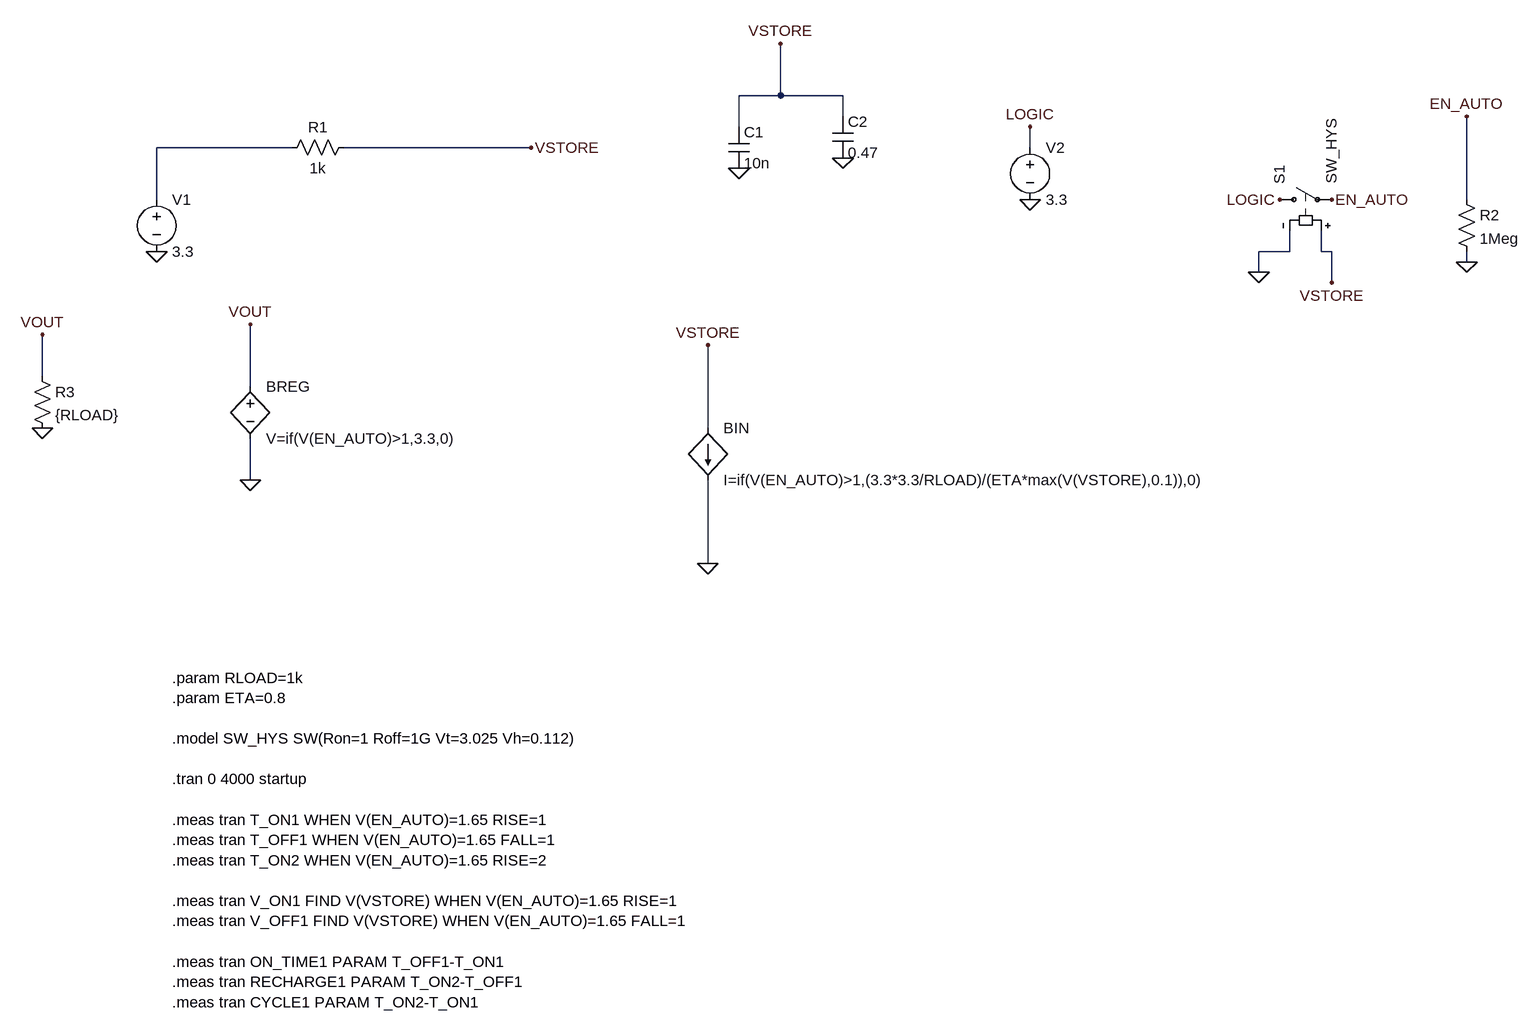
[diagram p0: schematic V2B1_LTC1540_Threshold.asc]
V2B1_LTC1540_Threshold.asc, the LTspice schematic file:
Version 4.1
SHEET 1 2020 1492
WIRE 688 48 688 -32
WIRE 688 48 624 48
WIRE 784 48 688 48
WIRE 784 80 784 48
WIRE 624 96 624 48
WIRE -64 128 -272 128
WIRE 304 128 16 128
WIRE 1072 128 1072 96
WIRE -272 208 -272 128
WIRE 1744 208 1744 80
WIRE 1472 288 1472 256
WIRE 1472 288 1424 288
WIRE 1520 288 1520 256
WIRE 1536 288 1520 288
WIRE 1744 304 1744 288
WIRE 1424 320 1424 288
WIRE 1536 336 1536 288
WIRE -448 480 -448 416
WIRE -128 496 -128 400
WIRE 576 560 576 432
WIRE -128 640 -128 576
WIRE 576 768 576 640
FLAG -272 288 0
FLAG 784 144 0
FLAG 304 128 VSTORE
FLAG 688 -32 VSTORE
FLAG 624 160 0
FLAG 1072 96 LOGIC
FLAG 1072 208 0
FLAG 1456 208 LOGIC
FLAG 1536 208 EN_AUTO
FLAG 1536 336 VSTORE
FLAG 1424 320 0
FLAG 1744 304 0
FLAG 1744 80 EN_AUTO
FLAG -128 400 VOUT
FLAG 576 432 VSTORE
FLAG 576 768 0
FLAG -128 640 0
FLAG -448 560 0
FLAG -448 416 VOUT
SYMBOL voltage -272 192 R0
SYMATTR InstName V1
SYMATTR Value 3.3
SYMBOL res 32 112 R90
WINDOW 0 0 56 VBottom 2
WINDOW 3 32 56 VTop 2
SYMATTR InstName R1
SYMATTR Value 1k
SYMBOL cap 768 80 R0
SYMATTR InstName C2
SYMATTR Value 0.47
SYMBOL cap 608 96 R0
SYMATTR InstName C1
SYMATTR Value 10n
SYMBOL voltage 1072 112 R0
SYMATTR InstName V2
SYMATTR Value 3.3
SYMBOL sw 1440 208 R270
SYMATTR InstName S1
SYMATTR Value SW_HYS
SYMBOL res 1728 192 R0
SYMATTR InstName R2
SYMATTR Value 1Meg
SYMBOL bv -128 480 R0
SYMATTR InstName BREG
SYMATTR Value V=if(V(EN_AUTO)>1,3.3,0)
SYMBOL bi 576 560 R0
SYMATTR InstName BIN
SYMATTR Value I=if(V(EN_AUTO)>1,(3.3*3.3/RLOAD)/(ETA*max(V(VSTORE),0.1)),0)
SYMBOL res -464 464 R0
SYMATTR InstName R3
SYMATTR Value {RLOAD}
TEXT -248 944 Left 2 !.param RLOAD=1k\n.param ETA=0.8\n \n.model SW_HYS SW(Ron=1 Roff=1G Vt=3.025 Vh=0.112)\n \n.tran 0 4000 startup\n \n.meas tran T_ON1 WHEN V(EN_AUTO)=1.65 RISE=1\n.meas tran T_OFF1 WHEN V(EN_AUTO)=1.65 FALL=1\n.meas tran T_ON2 WHEN V(EN_AUTO)=1.65 RISE=2\n \n.meas tran V_ON1 FIND V(VSTORE) WHEN V(EN_AUTO)=1.65 RISE=1\n.meas tran V_OFF1 FIND V(VSTORE) WHEN V(EN_AUTO)=1.65 FALL=1\n \n.meas tran ON_TIME1 PARAM T_OFF1-T_ON1\n.meas tran RECHARGE1 PARAM T_ON2-T_OFF1\n.meas tran CYCLE1 PARAM T_ON2-T_ON1

The netlist it stands for:
* V2B1_LTC1540_Threshold.asc
V1 N001 0 3.3
R1 VSTORE N001 1k
C2 VSTORE 0 0.47
C1 VSTORE 0 10n
V2 LOGIC 0 3.3
S1 LOGIC EN_AUTO VSTORE 0 SW_HYS
R2 EN_AUTO 0 1Meg
BREG VOUT 0 V=if(V(EN_AUTO)>1,3.3,0)
BIN VSTORE 0 I=if(V(EN_AUTO)>1,(3.3*3.3/RLOAD)/(ETA*max(V(VSTORE),0.1)),0)
R3 VOUT 0 {RLOAD}
.param RLOAD=1k
.param ETA=0.8
.model SW_HYS SW(Ron=1 Roff=1G Vt=3.025 Vh=0.112)
.tran 0 4000 startup
.meas tran T_ON1 WHEN V(EN_AUTO)=1.65 RISE=1
.meas tran T_OFF1 WHEN V(EN_AUTO)=1.65 FALL=1
.meas tran T_ON2 WHEN V(EN_AUTO)=1.65 RISE=2
.meas tran V_ON1 FIND V(VSTORE) WHEN V(EN_AUTO)=1.65 RISE=1
.meas tran V_OFF1 FIND V(VSTORE) WHEN V(EN_AUTO)=1.65 FALL=1
.meas tran ON_TIME1 PARAM T_OFF1-T_ON1
.meas tran RECHARGE1 PARAM T_ON2-T_OFF1
.meas tran CYCLE1 PARAM T_ON2-T_ON1
.backanno
.end